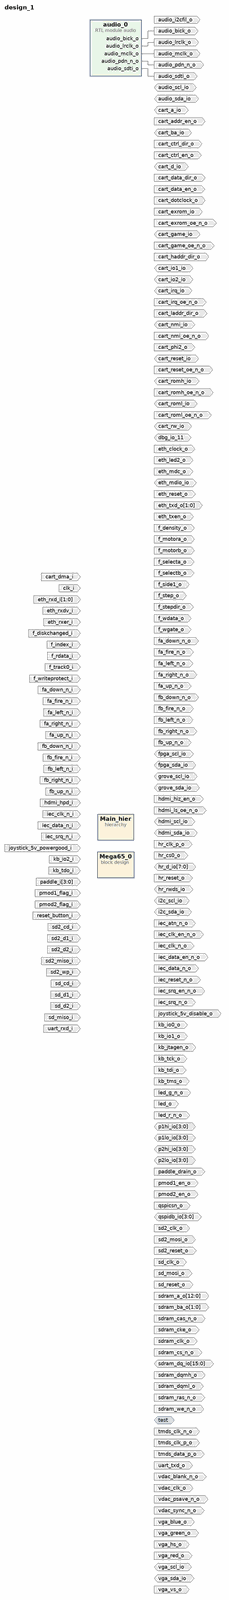
[diagram p0: block diagram of the top level, whole]
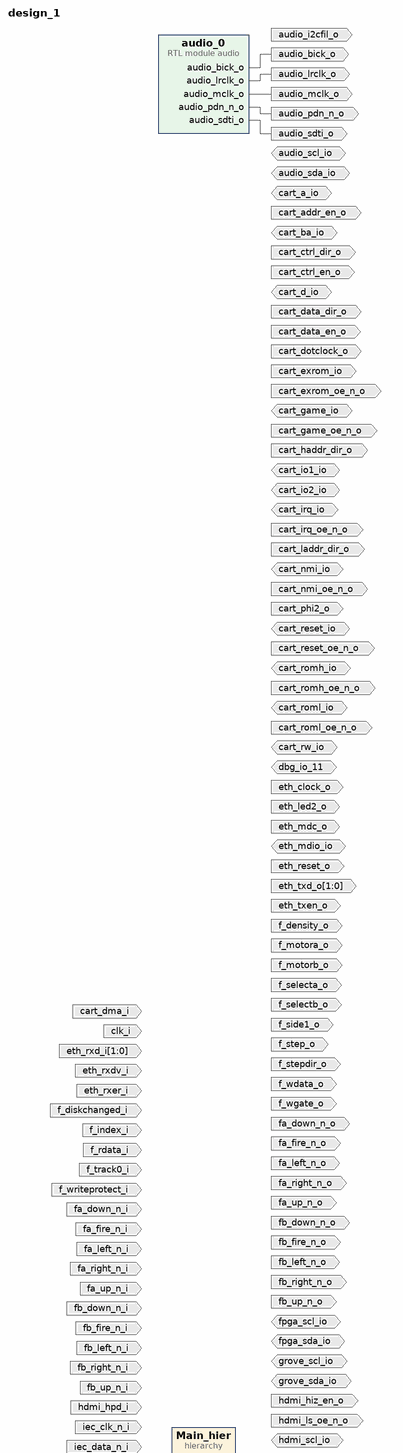
[diagram p1: block diagram of the top level, upper part]
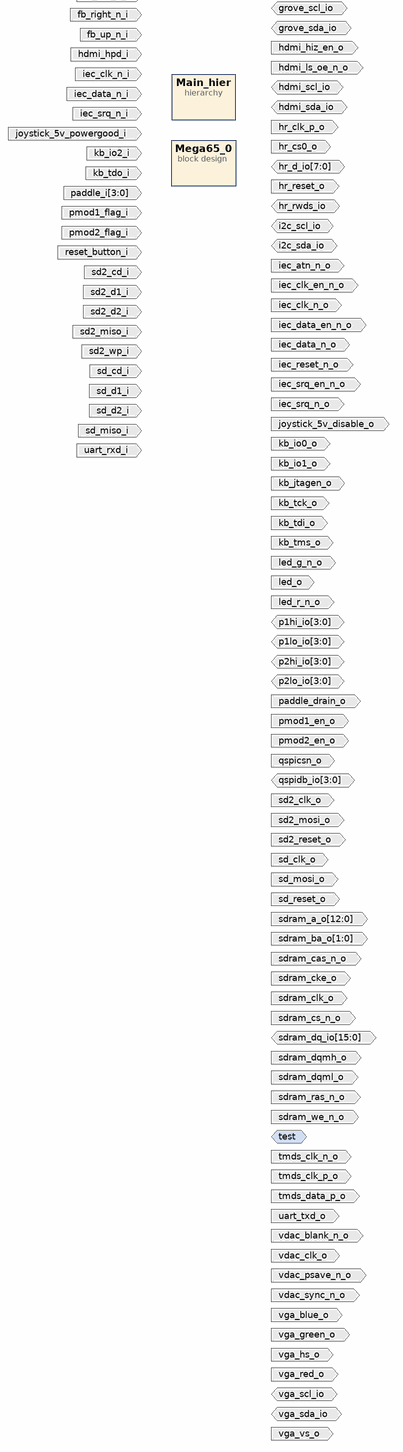
[diagram p2: block diagram of the top level, lower part]
# Vivado block design design_1, xc7a200tfbg484-2, Vivado 2024.2.1
create_bd_design design_1

create_bd_intf_port -mode Master -vlnv xilinx.com:display_aurora:core_status_out_rtl:1.0 test
create_bd_port -dir I -type clk clk_i
set_property -dict {CONFIG.FREQ_HZ 100000000} [get_bd_ports clk_i]
create_bd_port -dir I -type rst reset_button_i
set_property -dict {CONFIG.POLARITY ACTIVE_HIGH} [get_bd_ports reset_button_i]
create_bd_port -dir I uart_rxd_i
create_bd_port -dir O uart_txd_o
create_bd_port -dir O vga_red_o
create_bd_port -dir O vga_green_o
create_bd_port -dir O vga_blue_o
create_bd_port -dir O vga_hs_o
create_bd_port -dir O vga_vs_o
create_bd_port -dir IO vga_scl_io
create_bd_port -dir IO vga_sda_io
create_bd_port -dir O vdac_clk_o
create_bd_port -dir O vdac_sync_n_o
create_bd_port -dir O vdac_blank_n_o
create_bd_port -dir O vdac_psave_n_o
create_bd_port -dir O tmds_data_p_o
create_bd_port -dir O tmds_clk_p_o
create_bd_port -dir O tmds_clk_n_o
create_bd_port -dir O hdmi_hiz_en_o
create_bd_port -dir O hdmi_ls_oe_n_o
create_bd_port -dir I hdmi_hpd_i
create_bd_port -dir IO hdmi_scl_io
create_bd_port -dir IO hdmi_sda_io
create_bd_port -dir O kb_io0_o
create_bd_port -dir O kb_io1_o
create_bd_port -dir I kb_io2_i
create_bd_port -dir O kb_tck_o
create_bd_port -dir I kb_tdo_i
create_bd_port -dir O kb_tms_o
create_bd_port -dir O kb_tdi_o
create_bd_port -dir O kb_jtagen_o
create_bd_port -dir O sd_reset_o
create_bd_port -dir O sd_clk_o
create_bd_port -dir O sd_mosi_o
create_bd_port -dir I sd_miso_i
create_bd_port -dir I sd_cd_i
create_bd_port -dir I sd_d1_i
create_bd_port -dir I sd_d2_i
create_bd_port -dir O sd2_reset_o
create_bd_port -dir O sd2_clk_o
create_bd_port -dir O sd2_mosi_o
create_bd_port -dir I sd2_miso_i
create_bd_port -dir I sd2_cd_i
create_bd_port -dir I sd2_wp_i
create_bd_port -dir I sd2_d1_i
create_bd_port -dir I sd2_d2_i
create_bd_port -dir O audio_mclk_o
create_bd_port -dir O audio_bick_o
create_bd_port -dir O audio_sdti_o
create_bd_port -dir O audio_lrclk_o
create_bd_port -dir O audio_pdn_n_o
create_bd_port -dir O audio_i2cfil_o
create_bd_port -dir IO audio_scl_io
create_bd_port -dir IO audio_sda_io
create_bd_port -dir I fa_up_n_i
create_bd_port -dir I fa_down_n_i
create_bd_port -dir I fa_left_n_i
create_bd_port -dir I fa_right_n_i
create_bd_port -dir I fa_fire_n_i
create_bd_port -dir O fa_fire_n_o
create_bd_port -dir O fa_up_n_o
create_bd_port -dir O fa_left_n_o
create_bd_port -dir O fa_down_n_o
create_bd_port -dir O fa_right_n_o
create_bd_port -dir I fb_up_n_i
create_bd_port -dir I fb_down_n_i
create_bd_port -dir I fb_left_n_i
create_bd_port -dir I fb_right_n_i
create_bd_port -dir I fb_fire_n_i
create_bd_port -dir O fb_up_n_o
create_bd_port -dir O fb_down_n_o
create_bd_port -dir O fb_fire_n_o
create_bd_port -dir O fb_right_n_o
create_bd_port -dir O fb_left_n_o
create_bd_port -dir O joystick_5v_disable_o
create_bd_port -dir I joystick_5v_powergood_i
create_bd_port -dir I -from 3 -to 0 paddle_i
create_bd_port -dir O paddle_drain_o
create_bd_port -dir IO -from 7 -to 0 hr_d_io
create_bd_port -dir IO hr_rwds_io
create_bd_port -dir O hr_reset_o
create_bd_port -dir O hr_clk_p_o
create_bd_port -dir O hr_cs0_o
create_bd_port -dir O iec_reset_n_o
create_bd_port -dir O iec_atn_n_o
create_bd_port -dir O iec_clk_en_n_o
create_bd_port -dir I iec_clk_n_i
create_bd_port -dir O iec_clk_n_o
create_bd_port -dir O iec_data_en_n_o
create_bd_port -dir I iec_data_n_i
create_bd_port -dir O iec_data_n_o
create_bd_port -dir O iec_srq_en_n_o
create_bd_port -dir I iec_srq_n_i
create_bd_port -dir O iec_srq_n_o
create_bd_port -dir O cart_phi2_o
create_bd_port -dir O cart_dotclock_o
create_bd_port -dir I cart_dma_i
create_bd_port -dir O cart_reset_oe_n_o
create_bd_port -dir IO cart_reset_io
create_bd_port -dir O cart_game_oe_n_o
create_bd_port -dir IO cart_game_io
create_bd_port -dir O cart_exrom_oe_n_o
create_bd_port -dir O cart_exrom_io
create_bd_port -dir O cart_nmi_oe_n_o
create_bd_port -dir IO cart_nmi_io
create_bd_port -dir O cart_irq_oe_n_o
create_bd_port -dir IO cart_irq_io
create_bd_port -dir O cart_ctrl_en_o
create_bd_port -dir O cart_ctrl_dir_o
create_bd_port -dir IO cart_ba_io
create_bd_port -dir IO cart_rw_io
create_bd_port -dir IO cart_io1_io
create_bd_port -dir IO cart_io2_io
create_bd_port -dir O cart_romh_oe_n_o
create_bd_port -dir IO cart_romh_io
create_bd_port -dir O cart_roml_oe_n_o
create_bd_port -dir IO cart_roml_io
create_bd_port -dir O cart_addr_en_o
create_bd_port -dir O cart_haddr_dir_o
create_bd_port -dir O cart_laddr_dir_o
create_bd_port -dir IO cart_a_io
create_bd_port -dir O cart_data_en_o
create_bd_port -dir O cart_data_dir_o
create_bd_port -dir IO cart_d_io
create_bd_port -dir O eth_clock_o
create_bd_port -dir O eth_led2_o
create_bd_port -dir O eth_mdc_o
create_bd_port -dir IO eth_mdio_io
create_bd_port -dir O eth_reset_o
create_bd_port -dir I eth_rxdv_i
create_bd_port -dir I eth_rxer_i
create_bd_port -dir O -from 1 -to 0 eth_txd_o
create_bd_port -dir O eth_txen_o
create_bd_port -dir I -from 1 -to 0 eth_rxd_i
create_bd_port -dir O f_density_o
create_bd_port -dir I f_diskchanged_i
create_bd_port -dir I f_index_i
create_bd_port -dir O f_motora_o
create_bd_port -dir O f_motorb_o
create_bd_port -dir I f_rdata_i
create_bd_port -dir O f_selecta_o
create_bd_port -dir O f_selectb_o
create_bd_port -dir O f_side1_o
create_bd_port -dir O f_stepdir_o
create_bd_port -dir O f_step_o
create_bd_port -dir I f_track0_i
create_bd_port -dir O f_wdata_o
create_bd_port -dir O f_wgate_o
create_bd_port -dir I f_writeprotect_i
create_bd_port -dir IO fpga_sda_io
create_bd_port -dir IO fpga_scl_io
create_bd_port -dir IO grove_sda_io
create_bd_port -dir IO grove_scl_io
create_bd_port -dir O led_g_n_o
create_bd_port -dir O led_r_n_o
create_bd_port -dir O led_o
create_bd_port -dir O pmod1_en_o
create_bd_port -dir I pmod1_flag_i
create_bd_port -dir O pmod2_en_o
create_bd_port -dir I pmod2_flag_i
create_bd_port -dir IO -from 3 -to 0 p1lo_io
create_bd_port -dir IO -from 3 -to 0 p1hi_io
create_bd_port -dir IO -from 3 -to 0 p2lo_io
create_bd_port -dir IO -from 3 -to 0 p2hi_io
create_bd_port -dir IO -from 3 -to 0 qspidb_io
create_bd_port -dir O qspicsn_o
create_bd_port -dir IO i2c_scl_io
create_bd_port -dir IO i2c_sda_io
create_bd_port -dir IO dbg_io_11
create_bd_port -dir O sdram_clk_o
create_bd_port -dir O sdram_cke_o
create_bd_port -dir O sdram_ras_n_o
create_bd_port -dir O sdram_cas_n_o
create_bd_port -dir O sdram_we_n_o
create_bd_port -dir O sdram_cs_n_o
create_bd_port -dir O -from 1 -to 0 sdram_ba_o
create_bd_port -dir O -from 12 -to 0 sdram_a_o
create_bd_port -dir O sdram_dqml_o
create_bd_port -dir O sdram_dqmh_o
create_bd_port -dir IO -from 15 -to 0 sdram_dq_io

create_bd_cell -type hier Main_hier
create_bd_cell -type module -reference audio audio_0
create_bd_cell -type container -reference Mega65 Mega65_0
set_property -dict [list \
  CONFIG.ACTIVE_SIM_BD Mega65.bd \
  CONFIG.ACTIVE_SYNTH_BD Mega65.bd \
  CONFIG.ENABLE_DFX 0 \
  CONFIG.LIST_SIM_BD Mega65.bd \
  CONFIG.LIST_SYNTH_BD Mega65.bd \
  CONFIG.LOCK_PROPAGATE 0 \
] [get_bd_cells Mega65_0]

# ---- hierarchy /Main_hier ----
current_bd_instance /Main_hier
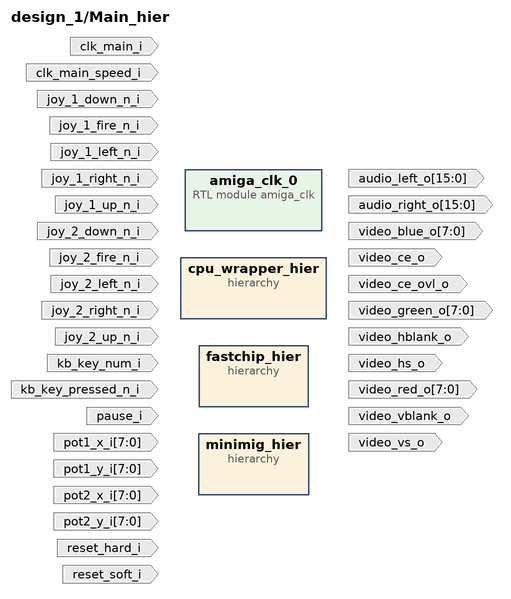
[diagram p3: block diagram inside /Main_hier]
create_bd_pin -dir I clk_main_i
create_bd_pin -dir I reset_soft_i
create_bd_pin -dir I reset_hard_i
create_bd_pin -dir I pause_i
create_bd_pin -dir I clk_main_speed_i
create_bd_pin -dir O video_ce_o
create_bd_pin -dir O video_ce_ovl_o
create_bd_pin -dir O -from 7 -to 0 video_red_o
create_bd_pin -dir O -from 7 -to 0 video_green_o
create_bd_pin -dir O -from 7 -to 0 video_blue_o
create_bd_pin -dir O video_vs_o
create_bd_pin -dir O video_hs_o
create_bd_pin -dir O video_hblank_o
create_bd_pin -dir O video_vblank_o
create_bd_pin -dir O -from 15 -to 0 audio_left_o
create_bd_pin -dir O -from 15 -to 0 audio_right_o
create_bd_pin -dir I kb_key_num_i
create_bd_pin -dir I kb_key_pressed_n_i
create_bd_pin -dir I joy_1_up_n_i
create_bd_pin -dir I joy_1_down_n_i
create_bd_pin -dir I joy_1_left_n_i
create_bd_pin -dir I joy_1_right_n_i
create_bd_pin -dir I joy_1_fire_n_i
create_bd_pin -dir I joy_2_up_n_i
create_bd_pin -dir I joy_2_down_n_i
create_bd_pin -dir I joy_2_left_n_i
create_bd_pin -dir I joy_2_right_n_i
create_bd_pin -dir I joy_2_fire_n_i
create_bd_pin -dir I -from 7 -to 0 pot1_x_i
create_bd_pin -dir I -from 7 -to 0 pot1_y_i
create_bd_pin -dir I -from 7 -to 0 pot2_x_i
create_bd_pin -dir I -from 7 -to 0 pot2_y_i

create_bd_cell -type module -reference amiga_clk amiga_clk_0
create_bd_cell -type hier fastchip_hier
create_bd_cell -type hier minimig_hier
create_bd_cell -type hier cpu_wrapper_hier

# ---- hierarchy /Main_hier/fastchip_hier ----
current_bd_instance /Main_hier/fastchip_hier
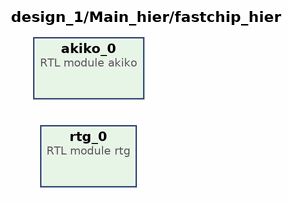
[diagram p4: block diagram inside /Main_hier/fastchip_hier]
create_bd_cell -type module -reference rtg rtg_0
create_bd_cell -type module -reference akiko akiko_0

# ---- hierarchy /Main_hier/minimig_hier ----
current_bd_instance /Main_hier/minimig_hier
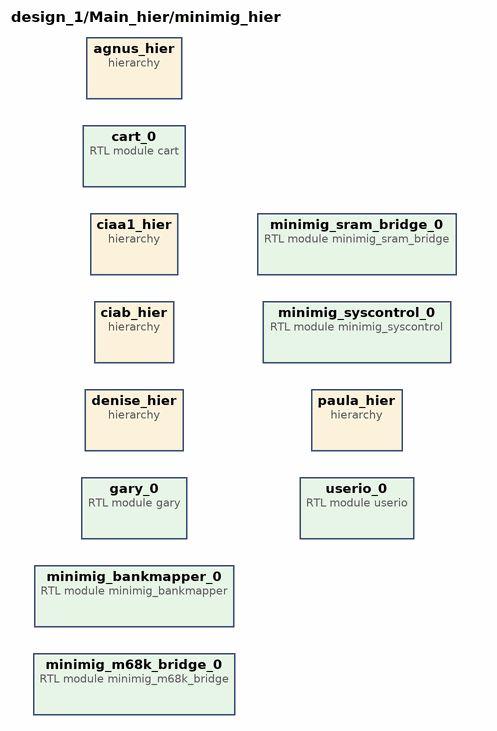
[diagram p5: block diagram inside /Main_hier/minimig_hier]
create_bd_cell -type hier paula_hier
create_bd_cell -type hier denise_hier
create_bd_cell -type hier agnus_hier
create_bd_cell -type hier ciaa1_hier
create_bd_cell -type hier ciab_hier
create_bd_cell -type module -reference userio userio_0
create_bd_cell -type module -reference minimig_m68k_bridge minimig_m68k_bridge_0
create_bd_cell -type module -reference minimig_bankmapper minimig_bankmapper_0
create_bd_cell -type module -reference minimig_sram_bridge minimig_sram_bridge_0
create_bd_cell -type module -reference cart cart_0
create_bd_cell -type module -reference gary gary_0
create_bd_cell -type module -reference minimig_syscontrol minimig_syscontrol_0

# ---- hierarchy /Main_hier/minimig_hier/paula_hier ----
current_bd_instance /Main_hier/minimig_hier/paula_hier
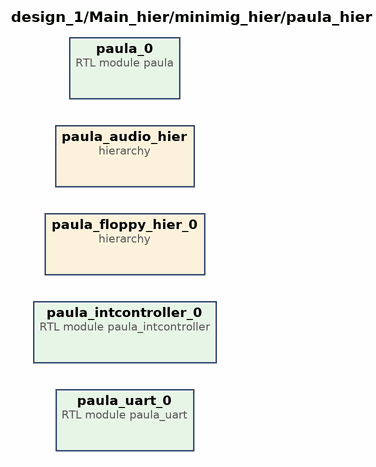
[diagram p6: block diagram inside /Main_hier/minimig_hier/paula_hier]
create_bd_cell -type module -reference paula paula_0
create_bd_cell -type module -reference paula_uart paula_uart_0
create_bd_cell -type module -reference paula_intcontroller paula_intcontroller_0
create_bd_cell -type hier paula_floppy_hier_0
create_bd_cell -type hier paula_audio_hier

# ---- hierarchy /Main_hier/minimig_hier/paula_hier/paula_floppy_hier_0 ----
current_bd_instance /Main_hier/minimig_hier/paula_hier/paula_floppy_hier_0
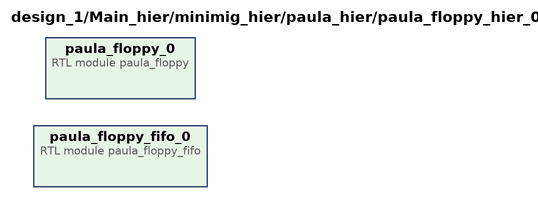
[diagram p7: block diagram inside /Main_hier/minimig_hier/paula_hier/paula_floppy_hier_0]
create_bd_cell -type module -reference paula_floppy paula_floppy_0
create_bd_cell -type module -reference paula_floppy_fifo paula_floppy_fifo_0

# ---- hierarchy /Main_hier/minimig_hier/paula_hier/paula_audio_hier ----
current_bd_instance /Main_hier/minimig_hier/paula_hier/paula_audio_hier
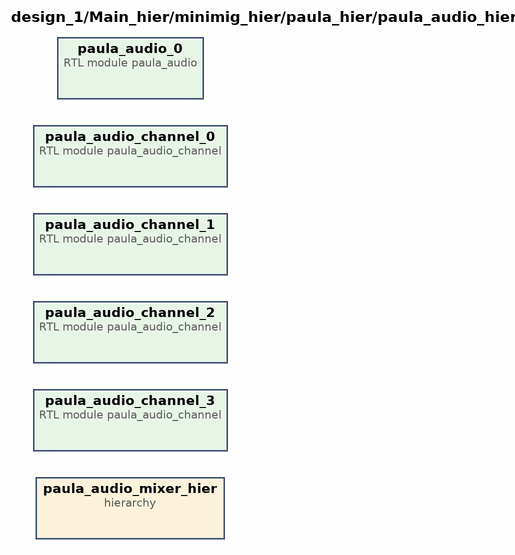
[diagram p8: block diagram inside /Main_hier/minimig_hier/paula_hier/paula_audio_hier]
create_bd_cell -type module -reference paula_audio paula_audio_0
create_bd_cell -type module -reference paula_audio_channel paula_audio_channel_0
create_bd_cell -type module -reference paula_audio_channel paula_audio_channel_1
create_bd_cell -type module -reference paula_audio_channel paula_audio_channel_2
create_bd_cell -type module -reference paula_audio_channel paula_audio_channel_3
create_bd_cell -type hier paula_audio_mixer_hier

# ---- hierarchy /Main_hier/minimig_hier/paula_hier/paula_audio_hier/paula_audio_mixer_hier ----
current_bd_instance /Main_hier/minimig_hier/paula_hier/paula_audio_hier/paula_audio_mixer_hier
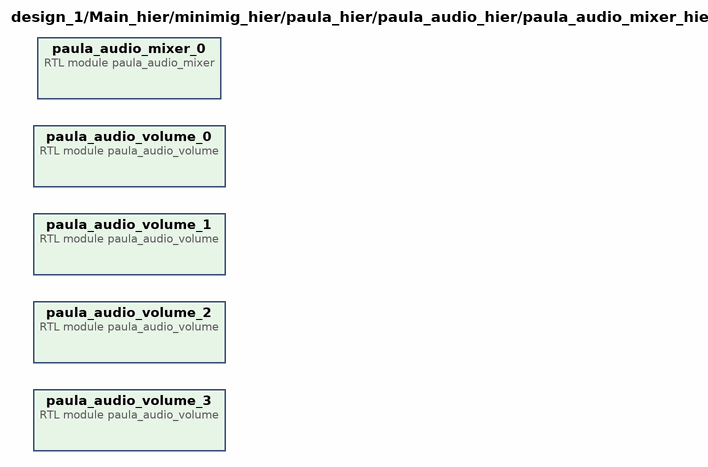
[diagram p9: block diagram inside /Main_hier/minimig_hier/paula_hier/paula_audio_hier/paula_audio_mixer_hier]
create_bd_cell -type module -reference paula_audio_mixer paula_audio_mixer_0
create_bd_cell -type module -reference paula_audio_volume paula_audio_volume_0
create_bd_cell -type module -reference paula_audio_volume paula_audio_volume_1
create_bd_cell -type module -reference paula_audio_volume paula_audio_volume_2
create_bd_cell -type module -reference paula_audio_volume paula_audio_volume_3

# ---- hierarchy /Main_hier/minimig_hier/denise_hier ----
current_bd_instance /Main_hier/minimig_hier/denise_hier
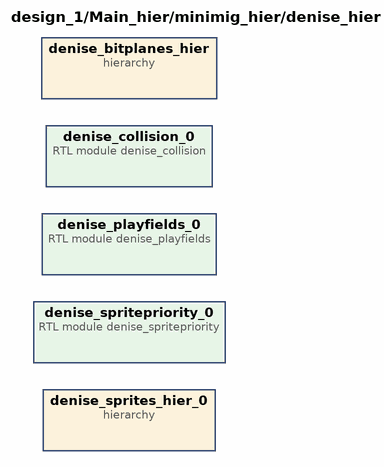
[diagram p10: block diagram inside /Main_hier/minimig_hier/denise_hier]
create_bd_cell -type module -reference denise_playfields denise_playfields_0
create_bd_cell -type hier denise_bitplanes_hier
create_bd_cell -type hier denise_sprites_hier_0
create_bd_cell -type module -reference denise_spritepriority denise_spritepriority_0
create_bd_cell -type module -reference denise_collision denise_collision_0

# ---- hierarchy /Main_hier/minimig_hier/denise_hier/denise_bitplanes_hier ----
current_bd_instance /Main_hier/minimig_hier/denise_hier/denise_bitplanes_hier
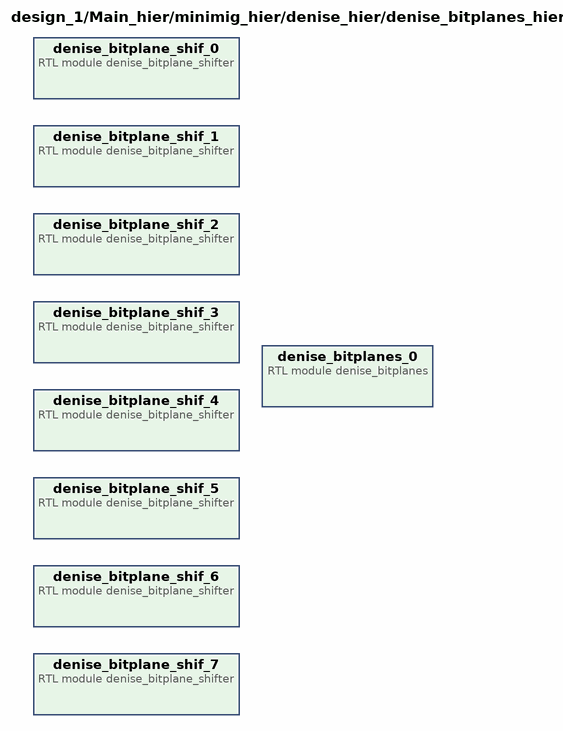
[diagram p11: block diagram inside /Main_hier/minimig_hier/denise_hier/denise_bitplanes_hier]
create_bd_cell -type module -reference denise_bitplanes denise_bitplanes_0
create_bd_cell -type module -reference denise_bitplane_shifter denise_bitplane_shif_0
create_bd_cell -type module -reference denise_bitplane_shifter denise_bitplane_shif_1
create_bd_cell -type module -reference denise_bitplane_shifter denise_bitplane_shif_2
create_bd_cell -type module -reference denise_bitplane_shifter denise_bitplane_shif_3
create_bd_cell -type module -reference denise_bitplane_shifter denise_bitplane_shif_4
create_bd_cell -type module -reference denise_bitplane_shifter denise_bitplane_shif_5
create_bd_cell -type module -reference denise_bitplane_shifter denise_bitplane_shif_6
create_bd_cell -type module -reference denise_bitplane_shifter denise_bitplane_shif_7

# ---- hierarchy /Main_hier/minimig_hier/denise_hier/denise_sprites_hier_0 ----
current_bd_instance /Main_hier/minimig_hier/denise_hier/denise_sprites_hier_0
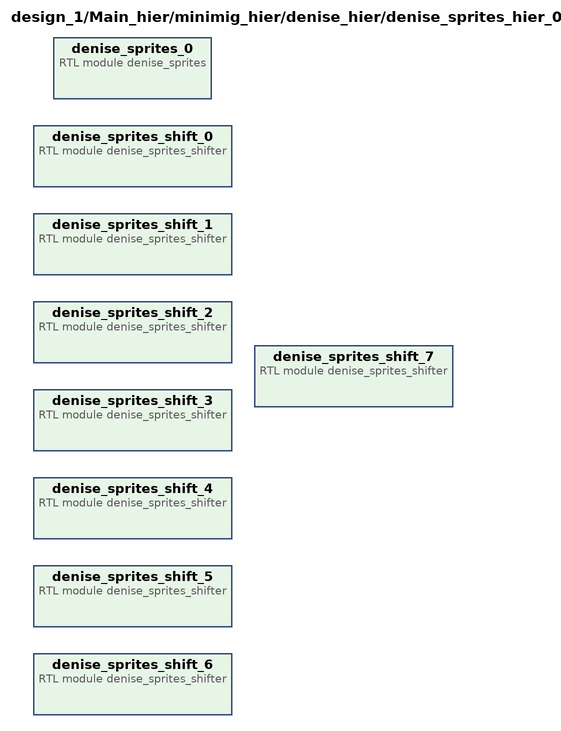
[diagram p12: block diagram inside /Main_hier/minimig_hier/denise_hier/denise_sprites_hier_0]
create_bd_cell -type module -reference denise_sprites denise_sprites_0
create_bd_cell -type module -reference denise_sprites_shifter denise_sprites_shift_0
create_bd_cell -type module -reference denise_sprites_shifter denise_sprites_shift_1
create_bd_cell -type module -reference denise_sprites_shifter denise_sprites_shift_2
create_bd_cell -type module -reference denise_sprites_shifter denise_sprites_shift_3
create_bd_cell -type module -reference denise_sprites_shifter denise_sprites_shift_4
create_bd_cell -type module -reference denise_sprites_shifter denise_sprites_shift_5
create_bd_cell -type module -reference denise_sprites_shifter denise_sprites_shift_6
create_bd_cell -type module -reference denise_sprites_shifter denise_sprites_shift_7

# ---- hierarchy /Main_hier/minimig_hier/agnus_hier ----
current_bd_instance /Main_hier/minimig_hier/agnus_hier
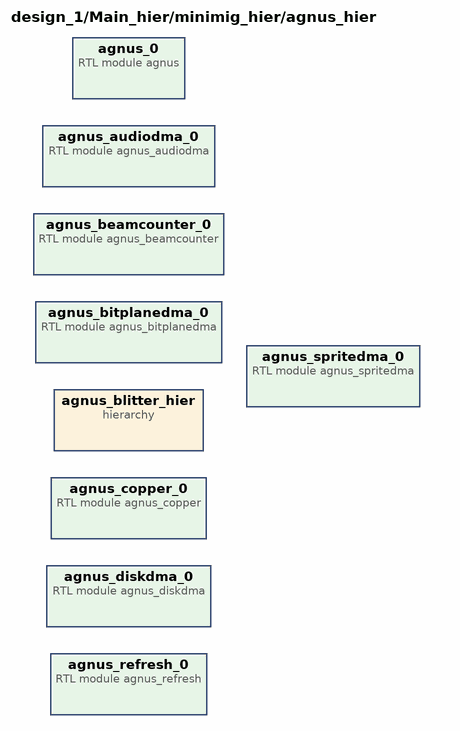
[diagram p13: block diagram inside /Main_hier/minimig_hier/agnus_hier]
create_bd_cell -type module -reference agnus agnus_0
create_bd_cell -type hier agnus_blitter_hier
create_bd_cell -type module -reference agnus_copper agnus_copper_0
create_bd_cell -type module -reference agnus_beamcounter agnus_beamcounter_0
create_bd_cell -type module -reference agnus_bitplanedma agnus_bitplanedma_0
create_bd_cell -type module -reference agnus_audiodma agnus_audiodma_0
create_bd_cell -type module -reference agnus_diskdma agnus_diskdma_0
create_bd_cell -type module -reference agnus_spritedma agnus_spritedma_0
create_bd_cell -type module -reference agnus_refresh agnus_refresh_0

# ---- hierarchy /Main_hier/minimig_hier/agnus_hier/agnus_blitter_hier ----
current_bd_instance /Main_hier/minimig_hier/agnus_hier/agnus_blitter_hier
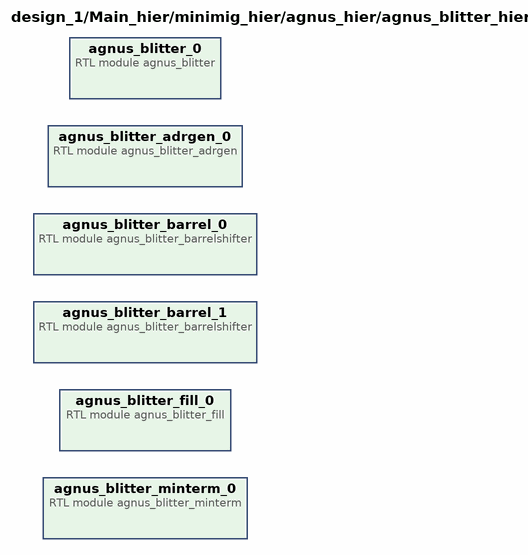
[diagram p14: block diagram inside /Main_hier/minimig_hier/agnus_hier/agnus_blitter_hier]
create_bd_cell -type module -reference agnus_blitter_barrelshifter agnus_blitter_barrel_0
create_bd_cell -type module -reference agnus_blitter_barrelshifter agnus_blitter_barrel_1
create_bd_cell -type module -reference agnus_blitter agnus_blitter_0
create_bd_cell -type module -reference agnus_blitter_minterm agnus_blitter_minterm_0
create_bd_cell -type module -reference agnus_blitter_fill agnus_blitter_fill_0
create_bd_cell -type module -reference agnus_blitter_adrgen agnus_blitter_adrgen_0

# ---- hierarchy /Main_hier/minimig_hier/ciaa1_hier ----
current_bd_instance /Main_hier/minimig_hier/ciaa1_hier
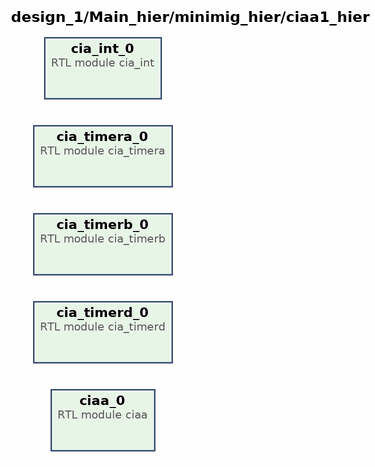
[diagram p15: block diagram inside /Main_hier/minimig_hier/ciaa1_hier]
create_bd_cell -type module -reference ciaa ciaa_0
create_bd_cell -type module -reference cia_int cia_int_0
create_bd_cell -type module -reference cia_timera cia_timera_0
create_bd_cell -type module -reference cia_timerb cia_timerb_0
create_bd_cell -type module -reference cia_timerd cia_timerd_0

# ---- hierarchy /Main_hier/minimig_hier/ciab_hier ----
current_bd_instance /Main_hier/minimig_hier/ciab_hier
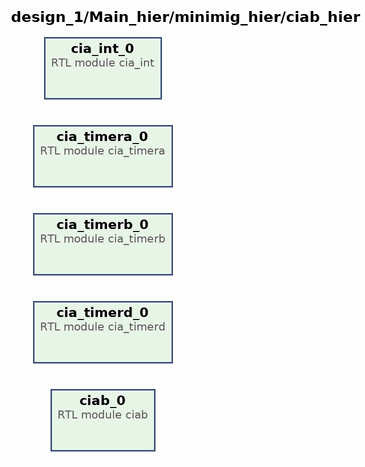
[diagram p16: block diagram inside /Main_hier/minimig_hier/ciab_hier]
create_bd_cell -type module -reference ciab ciab_0
create_bd_cell -type module -reference cia_int cia_int_0
create_bd_cell -type module -reference cia_timera cia_timera_0
create_bd_cell -type module -reference cia_timerb cia_timerb_0
create_bd_cell -type module -reference cia_timerd cia_timerd_0

# ---- hierarchy /Main_hier/cpu_wrapper_hier ----
current_bd_instance /Main_hier/cpu_wrapper_hier
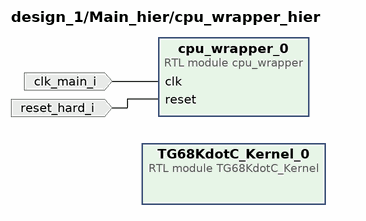
[diagram p17: block diagram inside /Main_hier/cpu_wrapper_hier]
create_bd_pin -dir I -type rst reset_hard_i
create_bd_pin -dir I clk_main_i

create_bd_cell -type module -reference cpu_wrapper cpu_wrapper_0
create_bd_cell -type module -reference TG68KdotC_Kernel TG68KdotC_Kernel_0

# ---- connections ----

current_bd_instance /Main_hier/cpu_wrapper_hier
connect_bd_net -net clk_0_main_clk_o [get_bd_pins clk_main_i] [get_bd_pins cpu_wrapper_0/clk]
connect_bd_net -net clk_0_main_rst_o [get_bd_pins reset_hard_i] [get_bd_pins cpu_wrapper_0/reset]

current_bd_instance /
connect_bd_net [get_bd_pins audio_0/audio_bick_o] [get_bd_ports audio_bick_o]
connect_bd_net [get_bd_pins audio_0/audio_lrclk_o] [get_bd_ports audio_lrclk_o]
connect_bd_net [get_bd_pins audio_0/audio_mclk_o] [get_bd_ports audio_mclk_o]
connect_bd_net [get_bd_pins audio_0/audio_pdn_n_o] [get_bd_ports audio_pdn_n_o]
connect_bd_net [get_bd_pins audio_0/audio_sdti_o] [get_bd_ports audio_sdti_o]

validate_bd_design
save_bd_design
